# EAGLE design CANreader-HS (EAGLE 7.6.0)
https://github.com/autowp/CANreader
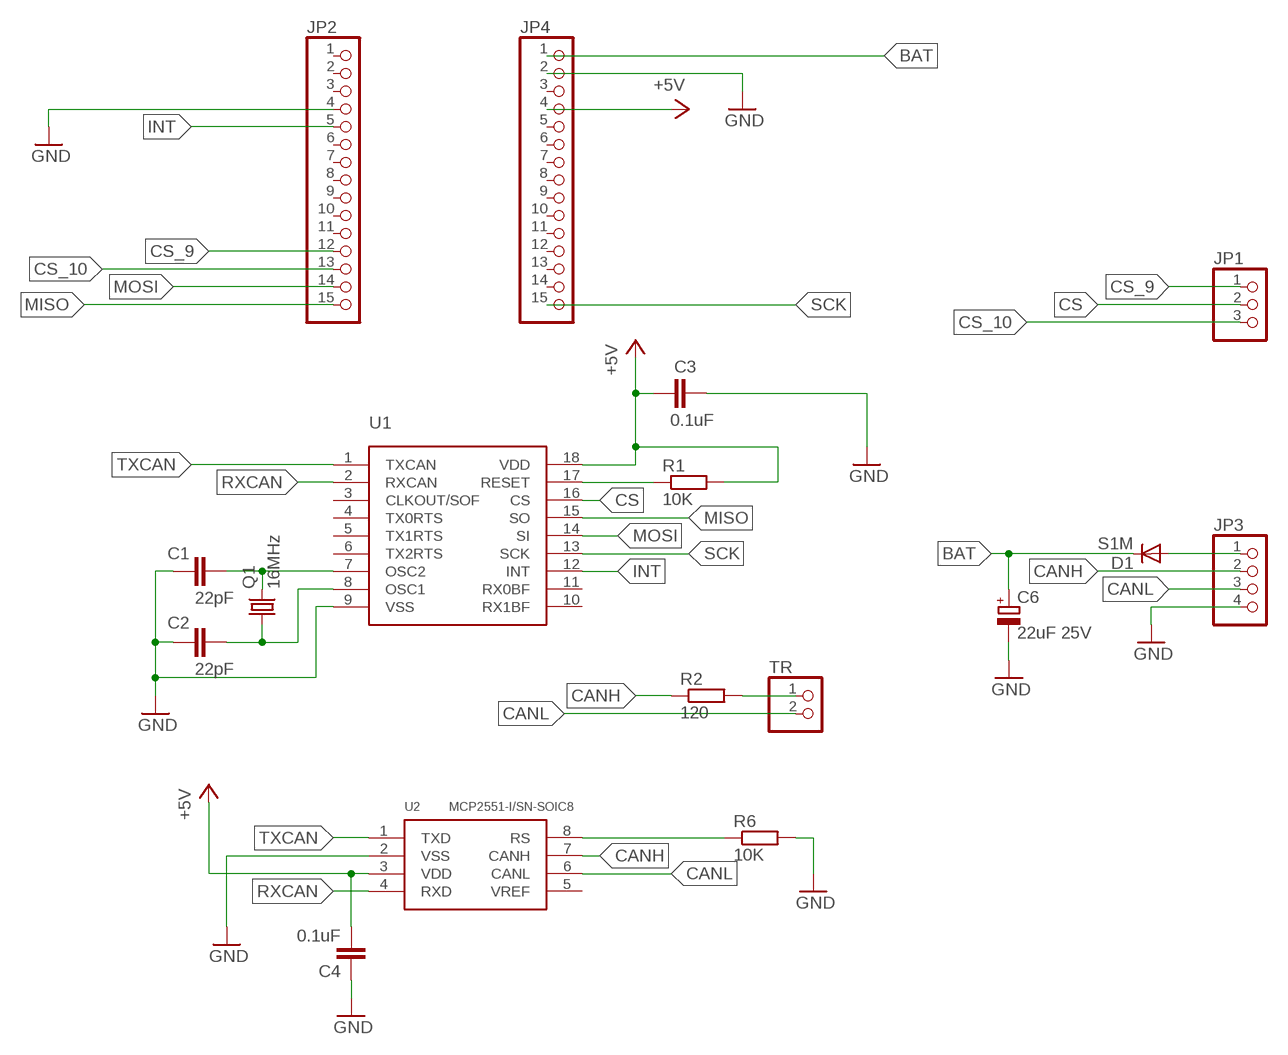
[diagram p0: schematic, sheet 1]

## Parts
C1  22pF  C-EUC0805  [C0805]
C2  22pF  C-EUC0805  [C0805]
C3  0.1uF  C-EUC0805  [C0805]
C4  0.1uF  C-EUC0805  [C0805]
C6  22uF 25V  CPOL-EUSMCC  [SMC_C]
D1  S1M  [SMA]
JP1  PINHD-1X3  [1X03]
JP2  PINHD-1X15  [1X15]
JP3  PINHD-1X4-1  [1X04]
JP4  PINHD-1X15  [1X15]
Q1  16MHz  CRYSTALHC49S  [HC49/S]
R1  10K  R-EU_R0805  [R0805]
R2  120  R-EU_R0805  [R0805]
R6  10K  R-EU_R0805  [R0805]
TR  PINHD-1X2  [1X02]
U1  MCP2515  [SO18-1]
U2  MCP2551-I/SN-SOIC8  INTERFACE-MCP2551-I/SN(SOIC8)  [SOIC8-1.27-5X4MM]

## Nets
+5V: C3.1 C4.2 JP4.4 R1.2 U1.18(VDD) U2.3(VDD)
BAT: C6.+ D1.C JP4.1
CANH: JP3.2 R2.1 U2.7(CANH)
CANL: JP3.3 TR.2 U2.6(CANL)
CS: JP1.2 U1.16(CS)
CS_9: JP1.1 JP2.12
CS_10: JP1.3 JP2.13
GND: C1.1 C2.1 C3.2 C4.1 C6.- JP2.4 JP3.4 JP4.2 R6.2 U1.9(VSS) U2.2(VSS)
INT: JP2.5 U1.12(INT)
MISO: JP2.15 U1.15(SO)
MOSI: JP2.14 U1.14(SI)
N$1: R2.2 TR.1
N$3: C1.2 Q1.2 U1.7(OSC2)
N$4: D1.A JP3.1
N$5: C2.2 Q1.1 U1.8(OSC1)
N$7: R1.1 U1.17(RESET)
N$12: R6.1 U2.8(RS)
RXCAN: U1.2(RXCAN) U2.4(RXD)
SCK: JP4.15 U1.13(SCK)
TXCAN: U1.1(TXCAN) U2.1(TXD)
Unconnected: JP2.1 JP2.2 JP2.3 JP2.6 JP2.7 JP2.8 JP2.9 JP2.10 JP2.11 JP4.3 JP4.5 JP4.6 JP4.7 JP4.8 JP4.9 JP4.10 JP4.11 JP4.12 JP4.13 JP4.14 U1.3(CLKOUT/SOF) U1.4(TX0RTS) U1.5(TX1RTS) U1.6(TX2RTS) U1.10(RX1BF) U1.11(RX0BF) U2.5(VREF)

## Library data of the parts
C1-C4 = rcl:C-EU: CAPACITOR, European symbol
C6 = rcl:CPOL-EU: POLARIZED CAPACITOR, European symbol
D1 = diode:S1M
JP1 = CAN_Shiel_Lib:PINHD-1X3: PIN HEADER
JP2 JP4 = CAN_Shiel_Lib:PINHD-1X15: PIN HEADER
JP3 = CAN_Shiel_Lib:PINHD-1X4-1: PIN HEADER
Q1 = crystal:CRYSTAL: CRYSTAL; OC_FARNELL: 1667008; OC_NEWARK: unknown
R1 R2 R6 = rcl:R-EU_: RESISTOR, European symbol
TR = CAN_Shiel_Lib:PINHD-1X2: PIN HEADER
U1 = CAN_Shiel_Lib:MCP2515
U2 = CAN_Shiel_Lib:INTERFACE-MCP2551-I/SN(SOIC8): 310070024; MPN: MCP2551-I/SN

## Board
https://github.com/autowp/CANreader
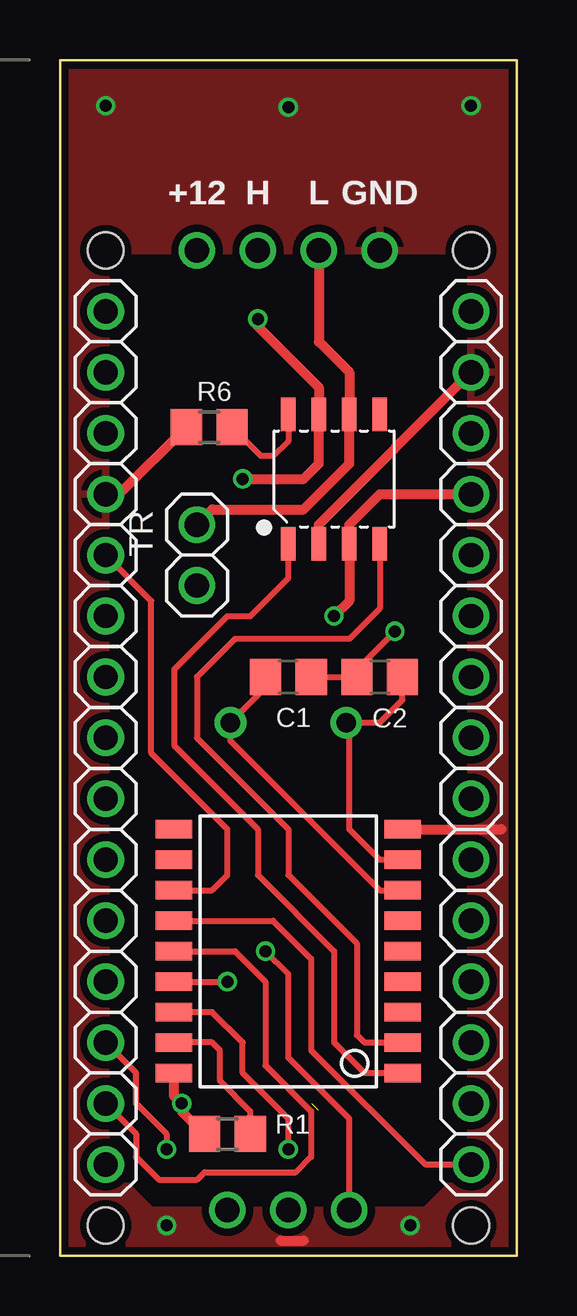
[diagram p1: board, top side]
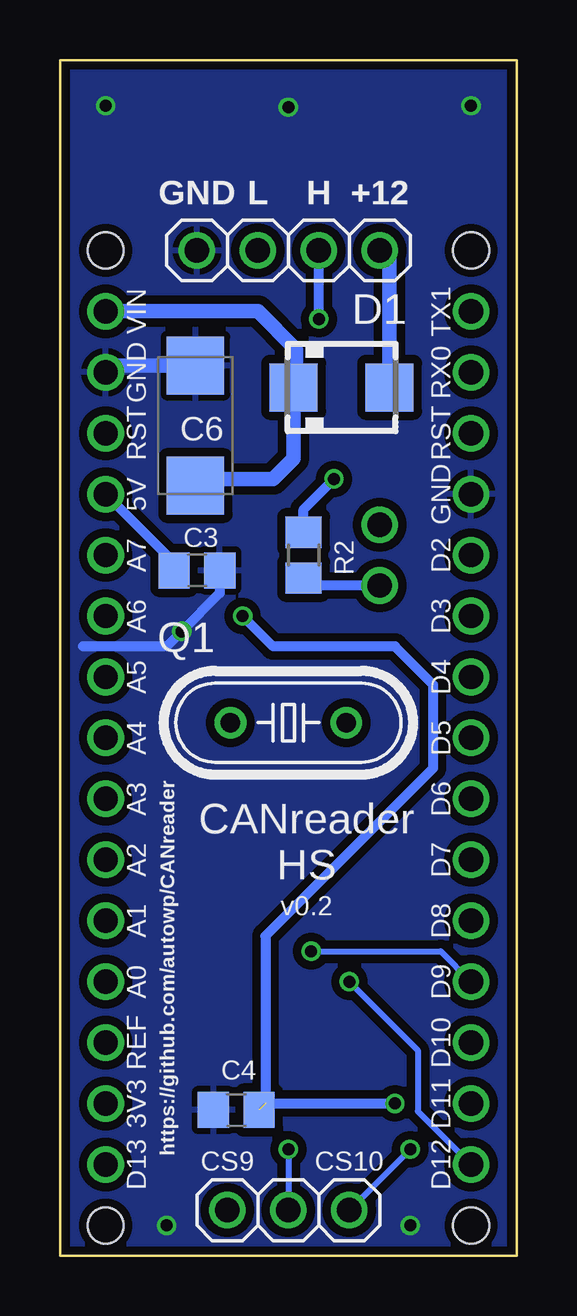
[diagram p2: board, bottom side, seen from below]

Size 19.05 x 49.85 mm. Coordinates in mm from the lower left corner, seen from the top.
Outline: 19.05,0 0,0 0,49.85 19.05,49.85 19.05,0
Copper layers (1*16): Top 0.035mm / dielectric 1.5mm / Bottom 0.035mm
Design rules "ITEADstudio_DRC": minimum track width 6mil, minimum drill 12mil, track to track 6mil, track to pad 6mil, pad to pad 6mil, via to via 6mil, smd to smd 0mil, copper to edge 10mil, drill to drill 10mil, minimum pad ring 10mil, minimum via ring 6mil, stop-mask expansion 2mil, vias tented up to drill 100mil, thermal gap 10mil
Holes 1.5 mm at 1.91,1.27 17.15,1.27 17.15,41.91 1.91,41.91

### Footprints (pad centres in the part's own frame; a part is rotated, then mirrored left to right if it is on the bottom)
C0805 = smd 1.3 x 1.5: 1 -0.95,0; 2 0.95,0
SMC_C = smd 2.4 x 2.4: + -2.5,0; - 2.5,0
SMA = smd 2 x 2: A 2,0; C -2,0
1X03 = drill 1.016: 1 -2.54,0; 2 0,0; 3 2.54,0
1X15 = drill 1.016: 1 -17.78,0; 2 -15.24,0; 3 -12.7,0; 4 -10.16,0; 5 -7.62,0; 6 -5.08,0; 7 -2.54,0; 8 0,0; 9 2.54,0; 10 5.08,0; 11 7.62,0; 12 10.16,0; 13 12.7,0; 14 15.24,0; 15 17.78,0
1X04 = drill 1.016: 1 -3.81,0; 2 -1.27,0; 3 1.27,0; 4 3.81,0
HC49/S = drill 0.813: 1 -2.413,0; 2 2.413,0
R0805 = smd 1.3 x 1.5: 1 -0.95,0; 2 0.95,0
1X02 = drill 1.016: 1 -1.27,0; 2 1.27,0
SO18-1 = smd 0.762 x 1.524: 1 -5.08,-4.775; 2 -3.81,-4.775; 3 -2.54,-4.775; 4 -1.27,-4.775; 5 0,-4.775; 6 1.27,-4.775; 7 2.54,-4.775; 8 3.81,-4.775; 9 5.08,-4.775; 10 5.08,4.775; 11 3.81,4.775; 12 2.54,4.775; 13 1.27,4.775; 14 0,4.775; 15 -1.27,4.775; 16 -2.54,4.775; 17 -3.81,4.775; 18 -5.08,4.775
SOIC8-1.27-5X4MM = smd 0.6 x 1.4: 1 -1.905,-2.7; 2 -0.635,-2.7; 3 0.635,-2.7; 4 1.905,-2.7; 5 1.905,2.7; 6 0.635,2.7; 7 -0.635,2.7; 8 -1.905,2.7

### Placement (x,y rotation side)
C1  9.52,24.13 180 top
C2  13.34,24.13 0 top
C3  13.34,28.58 0 bottom
C4  11.7,6.08 0 bottom
C6  13.4,34.61 90 bottom
D1  7.3,36.2 0 bottom
JP1  9.52,1.91 0 bottom
JP2  1.91,21.59 270 top
JP3  9.52,41.91 180 bottom
JP4  17.15,21.59 270 top
Q1  9.52,22.23 0 bottom
R1  6.98,5.08 180 top
R2  8.89,29.21 270 bottom
R6  6.22,34.54 180 top
TR  5.72,29.21 90 top
U1  9.52,12.7 90 top
U2  11.43,32.38 0 top

### Tracks (layer width: path | path; a pad name or v marks a point on that pad's centre or on a via)
+5V  (via drill 0.5)  (1 unrouted)
  Top 0.406: U1.18 4.75,6.68 v5.08,6.35 5.08,6.04 R1.2 | v11.43,26.67 12.06,27.3 U2.3 12.06,30.48 13.34,31.75 JP4.4
  Bottom 0.406: v5.08,6.35 10.48,6.35 10.48,13.33 3.49,20.32 3.49,23.81 5.08,25.4 10.16,25.4 v11.43,26.67 | C3.1 14.29,28.89 JP4.4
BAT
  Bottom 0.61: D1.C 9.52,36.2 | JP4.1 10.8,39.37 9.21,37.78 9.21,36.29 D1.C | D1.C 9.3,33.24 10.16,32.38 13.12,32.38 C6.+
CANH  (via drill 0.5)
  Top 0.406: v8.26,39.05 8.26,38.73 10.8,36.2 U2.7 10.8,33.02 10.16,32.38 v7.62,32.38
  Bottom 0.406: v8.26,39.05 JP3.2 | R2.1 8.89,31.12 v7.62,32.38
CANL
  Top 0.406: JP3.3 10.8,38.1 12.06,36.83 U2.6 12.06,33.02 10.16,31.12 6.35,31.12 TR.2
CS  (via drill 0.5)
  Top 0.254: v9.52,4.45 9.52,5.71 7.62,7.62 7.62,8.89 6.35,10.16 U1.16
  Bottom 0.254: v9.52,4.45 JP1.2
CS_9  (via drill 0.5)
  Top 0.254: JP1.1 12.06,5.71 9.52,8.25 9.52,11.75 v8.57,12.7
  Bottom 0.254: v8.57,12.7 3.17,12.7 JP2.12
CS_10  (via drill 0.5)
  Top 0.254: JP2.13 3.17,7.62 3.17,6.35 4.45,5.08 v4.45,4.45
  Bottom 0.254: JP1.3 v4.45,4.45
GND  (via drill 0.5)
  Top 0.254: C1.1 C2.1 12.38,24.45 v13.97,26.03
  Top 0.406: U1.9 18.41,17.78 | 9.21,0.63 10.16,0.63 | JP2.4 2.48,31.75 R6.2 | U2.2 10.8,30.48 JP4.2
  Bottom 0.406: 18.1,25.4 14.61,25.4 v13.97,26.03 12.38,27.62 C3.2
  Bottom 0.61: C6.- 16.87,37.11 JP4.2
  other vias: 14.61,1.27 4.45,1.27 17.15,47.94 1.91,47.94 9.52,47.88
  pour Top (isolate 0.305): 9.84,-1.27 20.95,-1.27 20.95,50.48 -1.91,50.48 -1.91,-1.27 9.52,-1.27 9.52,1.91 3.81,1.91 1.91,3.81 1.91,41.91 17.15,41.91 17.15,3.81 15.24,1.91 9.84,1.91
  pour Bottom (isolate 0.35): -4.45,53.34 24.77,53.34 24.77,-3.81 -4.45,-3.81
INT
  Top 0.254: JP2.5 3.81,27.3 3.81,20.95 6.98,17.78 6.98,15.88 6.35,15.24 U1.12
MISO  (via drill 0.5)
  Top 0.254: U1.15 v6.98,11.43
  Bottom 0.254: v6.98,11.43 4.13,8.57 4.13,6.03 JP2.15
MOSI
  Top 0.254: U1.14 7.3,12.7 8.57,11.43 8.57,7.94 10.48,6.03 10.48,4.13 9.84,3.49 6.03,3.49 5.72,3.18 4.13,3.18 3.17,4.13 3.17,5.08 JP2.14
N$1
  Bottom 0.406: TR.1 8.89,27.94 R2.2
N$3
  Top 0.254: U1.7 13.34,15.24 7.11,21.46 Q1.2 8.58,23.69 C1.2
N$4
  Bottom 0.61: D1.A 5.3,41.5 JP3.1
N$5
  Top 0.254: U1.8 13.34,16.51 12.06,17.78 12.06,21.72 Q1.1 13.34,22.23 14.29,23.17 C2.2
N$7
  Top 0.254: R1.1 7.94,6.04 6.67,7.3 6.67,8.57 6.35,8.89 U1.17
N$12
  Top 0.254: U2.8 9.52,33.97 8.89,33.34 8.38,33.34 R6.1
RXCAN
  Top 0.254: U2.4 13.34,26.99 12.06,25.72 7.3,25.72 5.72,24.13 5.72,21.59 9.52,17.78 9.52,15.88 12.38,13.02 12.38,9.21 12.7,8.89 U1.2
SCK
  Top 0.254: U1.13 8.89,13.97 10.48,12.38 10.48,8.57 15.24,3.81 JP4.15
TXCAN
  Top 0.254: U1.1 12.7,7.62 11.43,8.89 11.43,12.7 8.26,15.88 8.26,17.78 4.76,21.27 4.76,24.45 6.98,26.67 7.94,26.67 9.52,28.26 U2.1

### Text on the board
tPlace: +12 | H | L | GND
bPlace: +12 | H | L | GND | TX1 | VIN | RX0 | GND | RST | RST | GND | 5V | D2 | A7 | D3 | A6 | D4 | A5 | D5 | A4 | https://github.com/autowp/CANreader | D6 | A3 | CANreader / HS | D7 | A2 | v0.2 | D8 | A1 | D9 | A0 | D10 | REF | D11 | 3V3 | D12 | CS10 | CS9 | D13